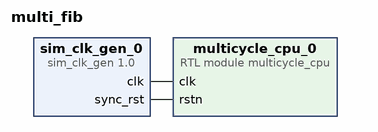
[diagram p0: block diagram of the top level]
# Vivado block design multi_fib, xcku040-ffva1156-2-e, Vivado 2020.1
create_bd_design multi_fib

create_bd_cell -type ip -vlnv xilinx.com:ip:sim_clk_gen:1.0 sim_clk_gen_0
set_property -dict [list \
  CONFIG.FREQ_HZ 1000000 \
  CONFIG.INITIAL_RESET_CLOCK_CYCLES 0 \
  CONFIG.RESET_POLARITY ACTIVE_LOW \
] [get_bd_cells sim_clk_gen_0]
create_bd_cell -type module -reference multicycle_cpu multicycle_cpu_0

# ---- connections ----

connect_bd_net [get_bd_pins sim_clk_gen_0/clk] [get_bd_pins multicycle_cpu_0/clk]
connect_bd_net [get_bd_pins sim_clk_gen_0/sync_rst] [get_bd_pins multicycle_cpu_0/rstn]

validate_bd_design
save_bd_design
